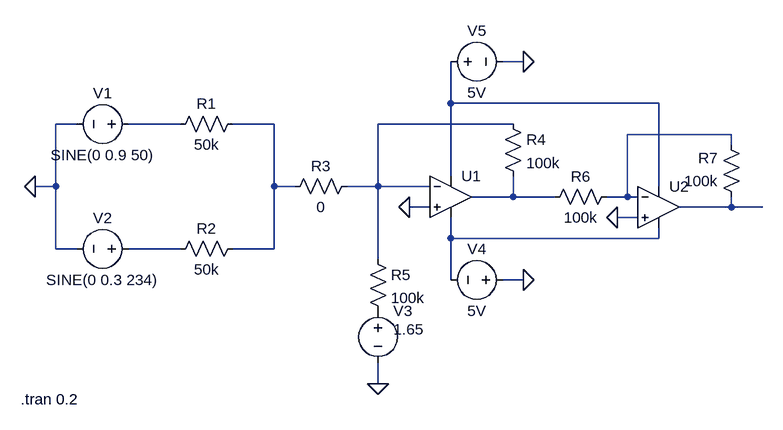
[diagram p0: schematic ChannelAdder_OffsetAndPotentiometer.asc]
ChannelAdder_OffsetAndPotentiometer.asc, the LTspice schematic file:
Version 4
SHEET 1 1080 680
WIRE 656 32 624 32
WIRE 544 96 544 32
WIRE 864 96 544 96
WIRE -32 128 -64 128
WIRE 128 128 48 128
WIRE 272 128 208 128
WIRE 640 128 432 128
WIRE 976 144 816 144
WIRE 976 160 976 144
WIRE 544 208 544 96
WIRE -64 224 -64 128
WIRE -64 224 -96 224
WIRE 272 224 272 128
WIRE 304 224 272 224
WIRE 432 224 432 128
WIRE 432 224 384 224
WIRE 512 224 432 224
WIRE 864 224 864 96
WIRE 640 240 640 208
WIRE 640 240 576 240
WIRE 704 240 640 240
WIRE 816 240 816 144
WIRE 816 240 784 240
WIRE 832 240 816 240
WIRE 512 256 480 256
WIRE 976 256 976 240
WIRE 976 256 896 256
WIRE 1024 256 976 256
WIRE 832 272 800 272
WIRE 544 304 544 272
WIRE 864 304 864 288
WIRE 864 304 544 304
WIRE -64 320 -64 224
WIRE -32 320 -64 320
WIRE 128 320 48 320
WIRE 272 320 272 224
WIRE 272 320 208 320
WIRE 432 336 432 224
WIRE 544 368 544 304
WIRE 656 368 624 368
WIRE 432 528 432 496
FLAG -96 224 0
FLAG 432 528 0
FLAG 656 32 0
FLAG 656 368 0
FLAG 480 256 0
FLAG 800 272 0
SYMBOL voltage 64 128 R90
WINDOW 0 -32 56 VBottom 2
WINDOW 3 32 56 VTop 2
WINDOW 123 0 0 Left 0
WINDOW 39 0 0 Left 0
SYMATTR InstName V1
SYMATTR Value SINE(0 0.9 50)
SYMBOL voltage 64 320 R90
WINDOW 0 -32 56 VBottom 2
WINDOW 3 32 56 VTop 2
WINDOW 123 0 0 Left 0
WINDOW 39 0 0 Left 0
SYMATTR InstName V2
SYMATTR Value SINE(0 0.3 234)
SYMBOL res 400 208 R90
WINDOW 0 0 56 VBottom 2
WINDOW 3 32 56 VTop 2
SYMATTR InstName R3
SYMATTR Value 0
SYMBOL OpAmps\\UniversalOpAmp 544 240 R0
SYMATTR InstName U1
SYMBOL res 624 112 R0
SYMATTR InstName R4
SYMATTR Value 100k
SYMBOL res 416 320 R0
SYMATTR InstName R5
SYMATTR Value 100k
SYMBOL voltage 432 400 R0
WINDOW 3 24 44 Left 2
WINDOW 123 0 0 Left 0
WINDOW 39 0 0 Left 0
SYMATTR InstName V3
SYMATTR Value 1.65
SYMBOL voltage 640 368 R90
WINDOW 0 -32 56 VBottom 2
WINDOW 3 32 56 VTop 2
WINDOW 123 0 0 Left 0
WINDOW 39 0 0 Left 0
SYMATTR InstName V4
SYMATTR Value 5V
SYMBOL voltage 528 32 R270
WINDOW 0 32 56 VTop 2
WINDOW 3 -32 56 VBottom 2
WINDOW 123 0 0 Left 0
WINDOW 39 0 0 Left 0
SYMATTR InstName V5
SYMATTR Value 5V
SYMBOL OpAmps\\UniversalOpAmp 864 256 R0
SYMATTR InstName U2
SYMBOL res 800 224 R90
WINDOW 0 0 56 VBottom 2
WINDOW 3 32 56 VTop 2
SYMATTR InstName R6
SYMATTR Value 100k
SYMBOL res 992 256 R180
WINDOW 0 36 76 Left 2
WINDOW 3 36 40 Left 2
SYMATTR InstName R7
SYMATTR Value 100k
SYMBOL res 224 112 R90
WINDOW 0 0 56 VBottom 2
WINDOW 3 32 56 VTop 2
SYMATTR InstName R1
SYMATTR Value 50k
SYMBOL res 224 304 R90
WINDOW 0 0 56 VBottom 2
WINDOW 3 32 56 VTop 2
SYMATTR InstName R2
SYMATTR Value 50k
TEXT -118 552 Left 2 !.tran 0.2

The netlist it stands for:
* ChannelAdder_OffsetAndPotentiometer.asc
V1 N002 0 SINE(0 0.9 50)
V2 N009 0 SINE(0 0.3 234)
R3 N004 N003 0
XU1 0 N004 N001 N008 N006 level1 Avol=1Meg GBW=10Meg Vos=0 En=0 Enk=0 In=0 Ink=0 Rin=500Meg  ; pins In+ In- V+ V- OUT
R4 N004 N006 100k
R5 N004 P001 100k
V3 P001 0 1.65
V4 0 N008 5V
V5 N001 0 5V
XU2 0 N005 N001 N008 N007 level1 Avol=1Meg GBW=10Meg Vos=0 En=0 Enk=0 In=0 Ink=0 Rin=500Meg  ; pins In+ In- V+ V- OUT
R6 N005 N006 100k
R7 N007 N005 100k
R1 N003 N002 50k
R2 N003 N009 50k
.tran 0.2
.lib UniversalOpAmp1.lib
.backanno
.end